# Altium schematic sheet [16] POWER.SchDoc: Power
size 299 x 210 mm; SheetNumber: 16; SheetTotal: 21; PageSetup: Record=PageOptions|CenterHorizontal=True|CenterVertical=True|PrintScale=0.94|XCorrection=0.00|YCorrection=0.00|PrintKind=0|BorderSize=5000000|LeftOffset=0|BottomOffset=0|Orientation=2|PaperLength=1000|PaperWidth=1000|Scale=100|PaperSource=15|PrintQuality=600|MediaType=1|DitherType=10|PrintScaleMode=1|PaperKind=A4; Adr1: August Barks gata 6B; Adr2: SE-421 32 Västra Frölunda; Adr3: Sweden; Webpage: www.omnisys.se
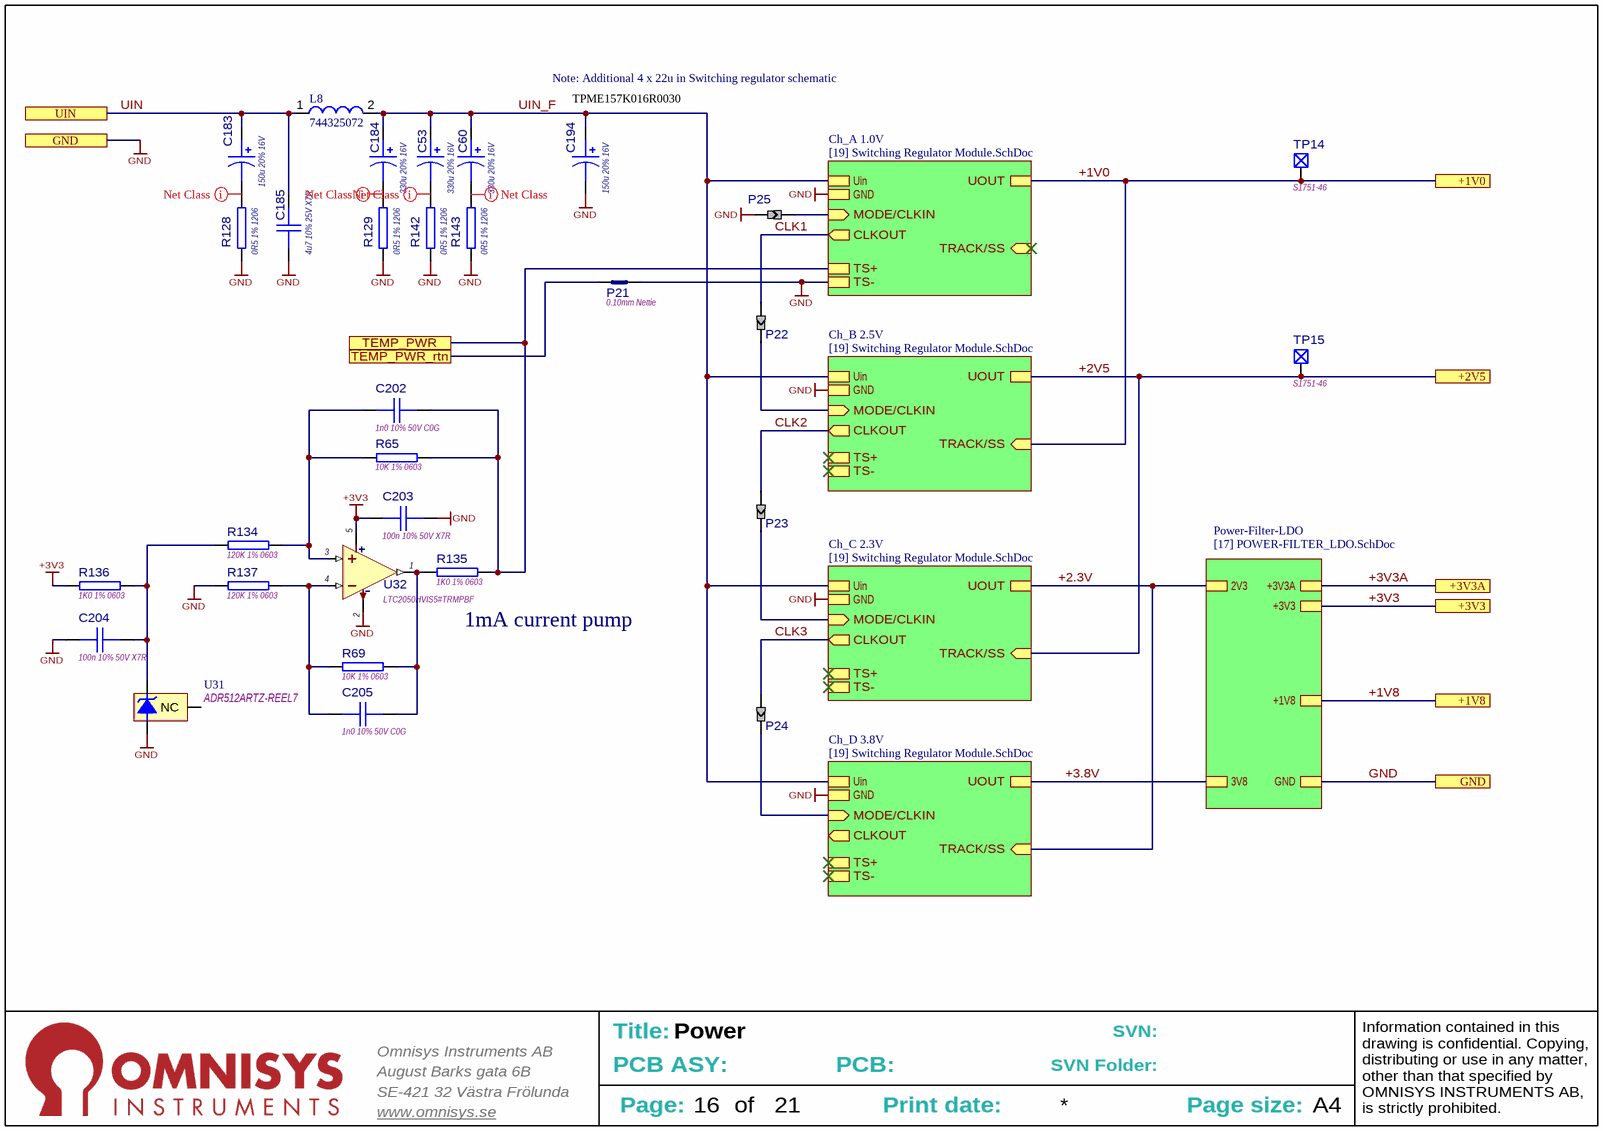
[diagram p0: [16] POWER.SchDoc]

## Parts
C53  330u 20% 16V  [CAPMP7343X43N]
C60  330u 20% 16V  [CAPMP7343X43N]
C183  150u 20% 16V  [CAPMP7343X43N]
C184  330u 20% 16V  [CAPMP7343X43N]
C185  4u7 10% 25V X7R  [CAPC3225X270N]
C194  150u 20% 16V  [CAPMP7343X43N]
C202  1n0 10% 50V C0G  [CAPC1608X90N]
C203  100n 10% 50V X7R  [CAPC1608X90N]
C204  100n 10% 50V X7R  [CAPC1608X90N]
C205  1n0 10% 50V C0G  [CAPC1608X90N]
L8  744325072  [WE-HCI-1050]
P21  0.10mm Nettie  [NETTIE_0.1MM]  (net tie, no BOM)
P22  Solder Jumper  [SolderJumper-Footprint-1]  (value not drawn)  (no BOM)
P23  Solder Jumper  [SolderJumper-Footprint-1]  (value not drawn)  (no BOM)
P24  Solder Jumper  [SolderJumper-Footprint-1]  (value not drawn)  (no BOM)
P25  Solder Jumper  [SolderJumper-Footprint-1]  (value not drawn)  (no BOM)
R65  10K 1% 0603  [RESC1608N]
R69  10K 1% 0603  [RESC1608N]
R128  0R5 1% 1206  [RESC3216N]
R129  0R5 1% 1206  [RESC3216N]
R134  120K 1% 0603  [RESC1608N]
R135  1K0 1% 0603  [RESC1608N]
R136  1K0 1% 0603  [RESC1608N]
R137  120K 1% 0603  [RESC1608N]
R142  0R5 1% 1206  [RESC3216N]
R143  0R5 1% 1206  [RESC3216N]
TP14  S1751-46  [S1751-46]
TP15  S1751-46  [S1751-46]
U31  ADR512ARTZ-REEL7  [SOT95P230X110-3N]
U32  LTC2050HVIS5#TRMPBF  [SOT95P280X100-5N]

## Sub-sheets
Ch_A 1.0V = [19] Switching Regulator Module.SchDoc: Uin, GND, CLKOUT (out), MODE/CLKIN (in), UOUT, TRACK/SS (in), TS-, TS+
Ch_B 2.5V = [19] Switching Regulator Module.SchDoc: Uin, GND, CLKOUT (out), MODE/CLKIN (in), UOUT, TRACK/SS (in), TS-, TS+
Ch_C 2.3V = [19] Switching Regulator Module.SchDoc: Uin, GND, CLKOUT (out), MODE/CLKIN (in), UOUT, TRACK/SS (in), TS-, TS+
Ch_D 3.8V = [19] Switching Regulator Module.SchDoc: Uin, GND, CLKOUT (out), MODE/CLKIN (in), UOUT, TRACK/SS (in), TS-, TS+
Power-Filter-LDO = [17] POWER-FILTER_LDO.SchDoc: +3V3, 3V8, +1V8, 2V3, GND, +3V3A

## Ports
+1V0, +1V8, +2V5, +3V3, +3V3A, GND, TEMP_PWR, TEMP_PWR_rtn, UIN

## Nets
+3V3: C203.2 R136.2 U32.5(+V) ; port +3V3, sheet Power-Filter-LDO/+3V3
GND: C185.2 C194.2 C203.1 C204.1 P21.2 P25.1 R128.2 R129.2 R137.1 R142.2 R143.2 U31.2(-V) U32.2(-V) ; port GND, sheet Ch_A 1.0V/GND, sheet Ch_A 1.0V/TS-, sheet Power-Filter-LDO/GND, sheet Ch_B 2.5V/GND, sheet Ch_C 2.3V/GND, sheet Ch_D 3.8V/GND
+1V0: TP14.1 ; port +1V0, sheet Ch_A 1.0V/UOUT, sheet Ch_B 2.5V/TRACK/SS
+1V8: port +1V8, sheet Power-Filter-LDO/+1V8
+2.3V: sheet Power-Filter-LDO/2V3, sheet Ch_C 2.3V/UOUT, sheet Ch_D 3.8V/TRACK/SS
+2V5: TP15.1 ; port +2V5, sheet Ch_B 2.5V/UOUT, sheet Ch_C 2.3V/TRACK/SS
+3.8V: sheet Power-Filter-LDO/3V8, sheet Ch_D 3.8V/UOUT
+3V3A: port +3V3A, sheet Power-Filter-LDO/+3V3A
CLK1: P22.1 ; sheet Ch_A 1.0V/CLKOUT
CLK2: P23.1 ; sheet Ch_B 2.5V/CLKOUT
CLK3: P24.1 ; sheet Ch_C 2.3V/CLKOUT
TEMP_PWR: C202.1 R65.2 R135.1 ; port TEMP_PWR, sheet Ch_A 1.0V/TS+
TEMP_PWR_rtn: P21.1 ; port TEMP_PWR_rtn
UIN: C183.1 C185.1 L8.1 ; port UIN
UIN_F: C53.1 C60.1 C184.1 C194.1 L8.2 ; sheet Ch_A 1.0V/Uin, sheet Ch_B 2.5V/Uin, sheet Ch_C 2.3V/Uin, sheet Ch_D 3.8V/Uin
NetC53_2: C53.2 R142.1
NetC60_2: C60.2 R143.1
NetC183_2: C183.2 R128.1
NetC184_2: C184.2 R129.1
NetC202_2: C202.2 R65.1 R134.2 U32.3(+IN)
NetC204_2: C204.2 R134.1 R136.1 U31.1(+V)
NetC205_1: C205.1 R69.2 R135.2 U32.1(OUT)
NetC205_2: C205.2 R69.1 R137.2 U32.4(-IN)
NetP22_2: P22.2 ; sheet Ch_B 2.5V/MODE/CLKIN
NetP23_2: P23.2 ; sheet Ch_C 2.3V/MODE/CLKIN
NetP24_2: P24.2 ; sheet Ch_D 3.8V/MODE/CLKIN
NetP25_2: P25.2 ; sheet Ch_A 1.0V/MODE/CLKIN

Not connected (* = marked no-connect by the designer): U31 3(NC)

## Layout directives
net class Power: NetC53_2, NetC60_2, NetC183_2, NetC184_2

## Notes on the sheet
- Note: Additional 4 x 22u in Switching regulator schematic
- (near C194) TPME157K016R0030
- (near R135) 1mA current pump
- August Barks gata 6B
- Omnisys Instruments AB
- Title:
- PCB ASY:
- PCB:
- SVN:
- SVN Folder:
- SE-421 32 Västra Frölunda
- www.omnisys.se
- Page:
- of
- Print date:
- Page size:
- A4
- Information contained in this drawing is confidential. Copying, distributing or use in any matter, other than that specified by OMNISYS INSTRUMENTS AB, is strictly prohibited.

## Library data of the parts
C53 C60 C184 = CMP-0300-000208-8: Standard tantalum capacitor, 7343/Case E; DCL: 52.8A; Capacitance: 330µF; DF: 30%; ESR: 0.4; Rated Voltage: 16V; Tolerance: 20%; Case/Package: 7343
C183 C194 = CMP-0300-000235-8: Standard tantalum capacitor, 7343/Case E; ESR: 0.3; DCL: 23A; Capacitance: 150µF; DF: 8%; Rated Voltage: 16V; Tolerance: 20%; Case/Package: 7343
C185 = CMP-0300-003012-4: Ceramic Chip Capacitor, 1210/3225; Capacitance: 4.7µF; Temperature Charateristics: X7R; Tolerance: 10%; Thickness: 2.7mm; Case/Package: 1210/3225; Rated Voltage: 25V
C202 C205 = CMP-0300-002463-5: Ceramic Chip Capacitor, 0603/1608; Tolerance: 5%; Capacitance: 1nF; Package: 1608/0603; Temperature Charateristics: C0G; Rated Voltage: 50V; Thickness: 900µm; Weight: 9mg
C203 C204 = CMP-0300-002665-6: Ceramic Chip Capacitor, 0603/1608; Capacitance: 100nF; Package: 1608/0603; Temperature Charateristics: X7R; Tolerance: 10%; Rated Voltage: 50V; Thickness: 900µm; Weight: 9mg
L8 = CMP-1200-000454-1: Inductor, SMD, 1005 0.72 uH 22 A ±20%, 744325072, Würth Elektronik; Inductance: 720nH; Test Frequency: 100kHz; DC Resistance (DCR): 1.3mR; Saturation Current: 35A; Shielding: Shielded; Self Resonant Frequency: 115MHz; RMS Current (Irms): 22A; Series Resistance: 1.3R; Length: 0.402inch; Mount: Surface Mount; Tolerance: 20%; Case/Package: Nonstandard; Inductance Tolerance: 20%; Termination: SMD/SMT; Composition: Wirewound; Height - Seated (Max): 0.197inch; Width: 10.2mm; Min Operating Temperature: -40°C; Height: 4.7mm; Package Quantity: 700; Max Operating Temperature: 150°C; Max DC Current: 22A; Current Rating: 22A; Packaging: Tape and Reel; REACH SVHC: Unknown
P21 = CMP-1600-000016-1: Copper object for merging nets on PCB
P22-P25 = CMP-1600-000025-5: Solder jumper, clearance 0.125mm
R65 R69 = CMP-1800-002045-5: Thick film Chip Resistor, 0603/1608; Power: 100mW; Maximum working voltage: 75V; Temp. Coefficent: 0.01%; Value: 10k; Tolerance: 1%; Case/Package: 0603/1608; Composition: Thick film
R128 R129 R142 R143 = CMP-1800-003168-2: Thick film Chip Resistor, 1206/3216; Value: 0.5; Temp. Coefficent: 0.01%; Maximum working voltage: 200V; Power: 250mW; Tolerance: 1%; Case/Package: 1206/3216; Composition: Thick film
R134 R137 = CMP-1800-002071-5: Thick film Chip Resistor, 0603/1608; Power: 100mW; Maximum working voltage: 75V; Temp. Coefficent: 0.01%; Value: 120k; Tolerance: 1%; Case/Package: 0603/1608; Composition: Thick film
R135 = CMP-1800-002021-5: Thick film Chip Resistor, 0603/1608; Value: 1k; Power: 100mW; Maximum working voltage: 75V; Temp. Coefficent: 0.01%; Tolerance: 1%; Case/Package: 0603/1608; Composition: Thick film
R136 = CMP-1800-002021-5: Thick film Chip Resistor, 0603/1608; Maximum working voltage: 75V; Temp. Coefficent: 0.01%; Value: 1k; Power: 100mW; Tolerance: 1%; Case/Package: 0603/1608; Composition: Thick film
TP14 TP15 = CMP-3600-000004-2: SMD Test point clip; PartNumber: S1751-46
U31 = CMP-2100-000594-1: 1.2 V Precision Low Noise Shunt Voltage Reference; Max Output Current: 10mA; Max Output Voltage: 1.2V; Temperature Coefficient: 60ppm/°C; Tolerance: 0.3%; Cathode Current: 100uA; Output Type: Fixed; Case/Package: SOT; Height: 1.02mm; Lead Free: Contains Lead; Length: 3.04mm; Max Operating Temperature: 85°C; Min Operating Temperature: -40°C; Number of Pins: 3; Output Current: 10mA; Output Voltage: 1.2V; Package Quantity: 1; Packaging: Tape and Reel; Radiation Hardening: No; REACH SVHC: No SVHC; Reference Type: Shunt; Reference Voltage: 1.2V; Width: 1.4mm; Min Output Voltage: 1.2V
U32 = CMP-2100-000593-1: Zero-Drift Operational Amplifiers in SOT-23; Common Mode Rejection Ratio: 120dB; Gain Bandwidth Product: 3MHz; Input Bias Current: 25pA; Input Offset Voltage (Vos): 0.5uV; Max Dual Supply Voltage: 5.5V; Max Frequency: 7.5kHz; Max Supply Voltage: 11V; Min Dual Supply Voltage: 1.35V; Min Supply Voltage: 2.7V; Number of Channels: 1; Operating Supply Current: 1mA; Slew Rate: 2V/µs; Voltage Gain: 140dB; Case/Package: SOT-23-5; Height: 0.9mm; Lead Free: Lead Free; Length: 2.9mm; Max Operating Temperature: 85°C; Min Operating Temperature: -40°C; Nominal Gain Bandwidth Product: 3MHz; Number of Circuits: 1; Number of Elements: 1; Number of Pins: 5; Package Quantity: 1; Packaging: Tape and Reel; Power Supply Rejection Ratio (PSRR): 120dB; Unity Gain Bandwidth Product: 3MHz; Width: 1.75mm